# EasyEDA schematic 1-Schematic_PCB1.json
TITLE: Basic PCB; REV: 1.0; Date: 2020-05-29; Sheet: 1/1; Drawn By: CheeseSteakJimmys; Company: Your Company
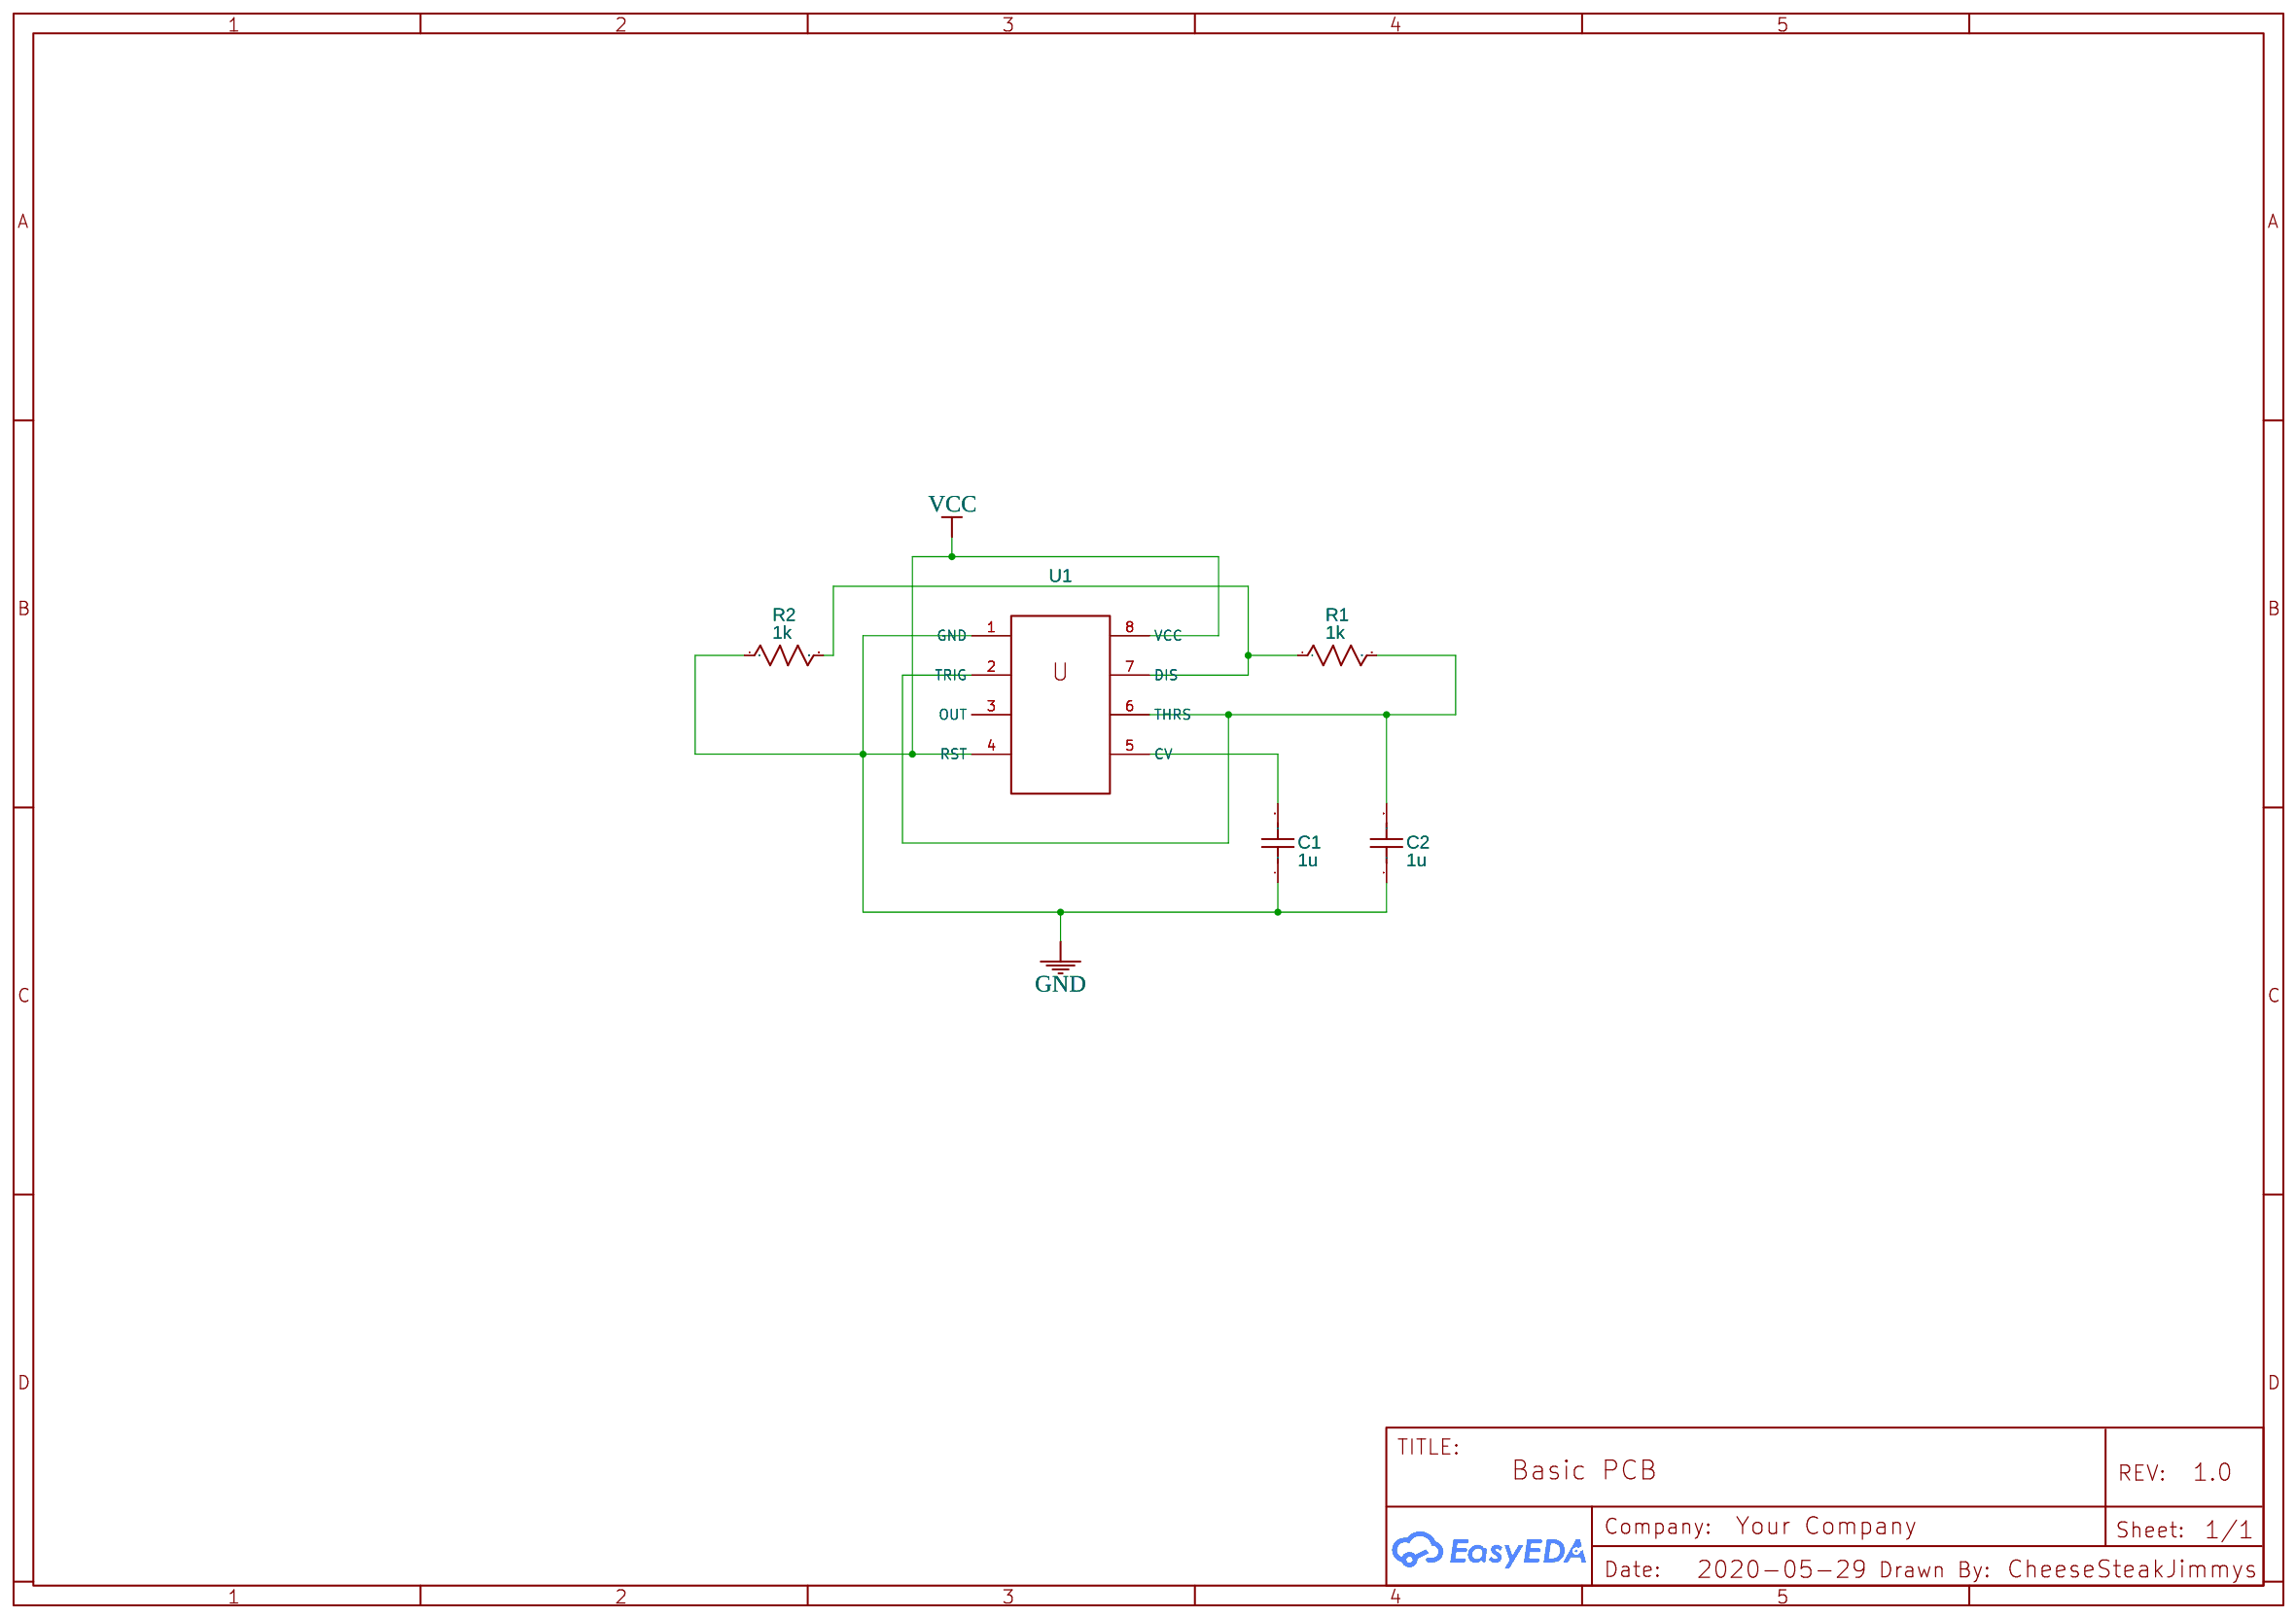
[diagram p0: schematic sheet]

## Parts
C1  1u  [C0201]
C2  1u  [C0201]
R1  1k  [R0201]
R2  1k  [R0201]
U1  U1  [8PIN IC SMD]

## Library data of the parts
C1 C2 = C_0201_US: Contributor: LCEDA_Lib
R1 R2 = R_0201_US: Contributor: LCEDA_Lib
U1 = U1: Supplier Part: undefined; Contributor: sandeep.adk

## Nets
GND: C1.1 C2.1 R2.1 U1.1(GND) U1.4(RST) U1.8(VCC)
Net-(C1-2): C1.2 U1.5(CV)
Net-(C2-2): C2.2 R1.2 U1.2(TRIG) U1.6(THRS)
Net-(R1-1): R1.1 R2.2 U1.7(DIS)

Not connected (* = marked no-connect by the designer): U1 3(OUT)
